# Altium schematic sheet g5.SchDoc
size A; SheetNumber: 13; SheetTotal: 17
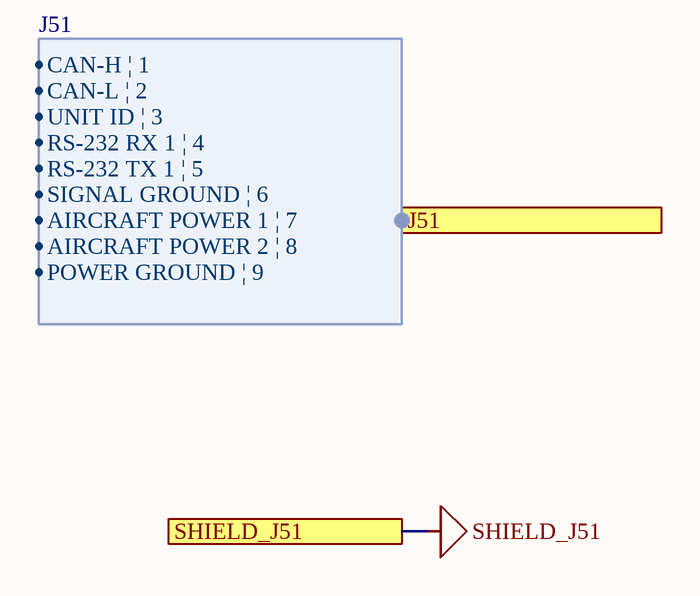
[diagram p0: g5.SchDoc]

## Ports
J51 (harness J51), SHIELD_J51

## Harnesses
J51: CAN-H | 1, CAN-L | 2, UNIT ID | 3, RS-232 RX 1 | 4, RS-232 TX 1 | 5, SIGNAL GROUND | 6, AIRCRAFT POWER 1 | 7, AIRCRAFT POWER 2 | 8, POWER GROUND | 9

## Nets
SHIELD_J51: port SHIELD_J51